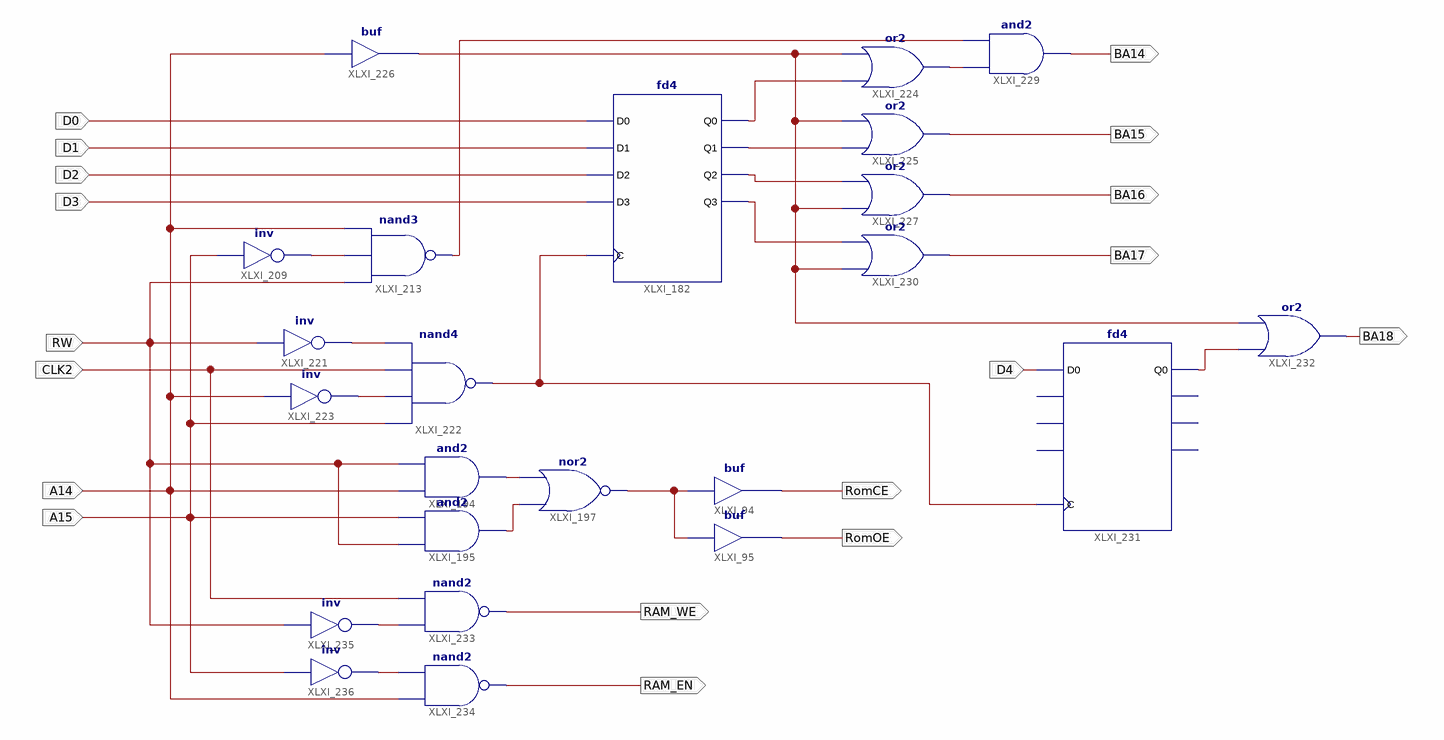
[diagram p0: schematic sheet 1]
// Xilinx ISE schematic A78maxi_512k_RAM2.sch (xc9500xl) as structural Verilog: 23 symbols, 18 ports
module A78maxi_512k_RAM2 (
  input  D0,
  input  D1,
  input  D2,
  input  A14,
  input  D3,
  input  CLK2,
  input  RW,
  input  A15,
  input  D4,
  output BA18,
  output RAM_EN,
  output BA17,
  output BA16,
  output BA14,
  output RomCE,
  output RomOE,
  output RAM_WE,
  output BA15
);

  wire XLXN_114, XLXN_277, XLXN_285, XLXN_286, XLXN_317, XLXN_335, XLXN_336, XLXN_337, XLXN_340, XLXN_346,
       XLXN_347, XLXN_352, XLXN_355, XLXN_365, XLXN_369, XLXN_371, XLXN_372;

  fd4 XLXI_182 (
    .C(XLXN_337), .D0(D0), .D1(D1), .D2(D2), .D3(D3), .Q0(XLXN_347), .Q1(XLXN_346), .Q2(XLXN_355),
    .Q3(XLXN_365));
  not XLXI_209 (XLXN_317, A15);
  nand XLXI_213 (XLXN_277, RW, XLXN_317, A14);
  and XLXI_194 (XLXN_286, A14, RW);
  and XLXI_195 (XLXN_285, RW, A15);
  nor XLXI_197 (XLXN_114, XLXN_285, XLXN_286);
  buf XLXI_95 (RomOE, XLXN_114);
  buf XLXI_94 (RomCE, XLXN_114);
  not XLXI_221 (XLXN_335, RW);
  nand XLXI_222 (XLXN_337, A15, XLXN_336, CLK2, XLXN_335);
  not XLXI_223 (XLXN_336, A14);
  or XLXI_224 (XLXN_340, XLXN_347, XLXN_352);
  or XLXI_225 (BA15, XLXN_346, XLXN_352);
  buf XLXI_226 (XLXN_352, A14);
  or XLXI_227 (BA16, XLXN_352, XLXN_355);
  and XLXI_229 (BA14, XLXN_340, XLXN_277);
  or XLXI_230 (BA17, XLXN_352, XLXN_365);
  fd4 XLXI_231 (.C(XLXN_337), .D0(D4), .Q0(XLXN_369));  // open: D1, D2, D3, Q1, Q2, Q3
  or XLXI_232 (BA18, XLXN_369, XLXN_352);
  nand XLXI_233 (RAM_WE, XLXN_371, CLK2);
  nand XLXI_234 (RAM_EN, A14, XLXN_372);
  not XLXI_235 (XLXN_371, RW);
  not XLXI_236 (XLXN_372, A15);

  // Notes on the sheet:
  //   LOC on signal D0 = 23
  //   LOC on signal D1 = 22
  //   LOC on signal D2 = 21
  //   LOC on signal BA18 = 39
  //   LOC on signal A14 = 37
  //   LOC on signal D3 = 20
  //   LOC on signal CLK2 = 44
  //   LOC on signal RAM_EN = 7
  //   LOC on signal RW = 43
  //   LOC on signal BA17 = 41
  //   LOC on signal BA16 = 38
  //   LOC on signal BA14 = 42
  //   LOC on signal A15 = 36
  //   LOC on signal RomCE = 8
  //   LOC on signal RomOE = 18
  //   LOC on signal RAM_WE = 40
  //   LOC on signal BA15 = 33
  //   LOC on signal D4 = 19
endmodule
